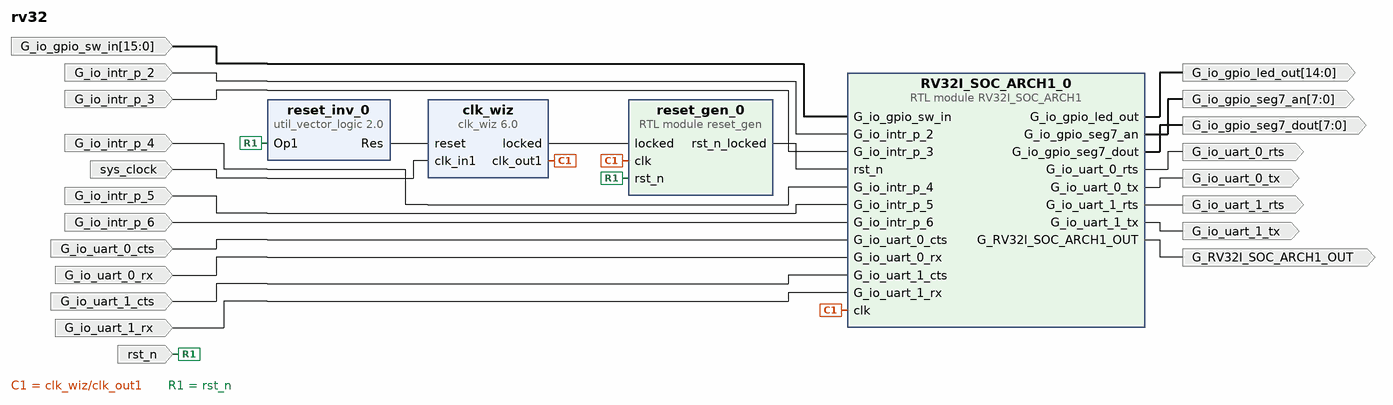
[diagram p0: block diagram of the top level]
# Vivado block design rv32, xc7a100tcsg324-1, Vivado 2024.2
create_bd_design rv32

create_bd_port -dir I -type clk sys_clock
set_property -dict {CONFIG.FREQ_HZ 100000000 CONFIG.PHASE 0.0} [get_bd_ports sys_clock]
create_bd_port -dir I -type rst rst_n
create_bd_port -dir I G_io_uart_0_rx
create_bd_port -dir I G_io_uart_0_cts
create_bd_port -dir I G_io_uart_1_rx
create_bd_port -dir I G_io_uart_1_cts
create_bd_port -dir I -from 15 -to 0 G_io_gpio_sw_in
create_bd_port -dir I G_io_intr_p_2
create_bd_port -dir I G_io_intr_p_3
create_bd_port -dir I G_io_intr_p_4
create_bd_port -dir I G_io_intr_p_5
create_bd_port -dir I G_io_intr_p_6
create_bd_port -dir O G_io_uart_0_tx
create_bd_port -dir O G_io_uart_0_rts
create_bd_port -dir O G_io_uart_1_tx
create_bd_port -dir O G_io_uart_1_rts
create_bd_port -dir O -from 7 -to 0 G_io_gpio_seg7_dout
create_bd_port -dir O -from 7 -to 0 G_io_gpio_seg7_an
create_bd_port -dir O -from 14 -to 0 G_io_gpio_led_out
create_bd_port -dir O G_RV32I_SOC_ARCH1_OUT

create_bd_cell -type module -reference RV32I_SOC_ARCH1 RV32I_SOC_ARCH1_0
create_bd_cell -type ip -vlnv xilinx.com:ip:clk_wiz:6.0 clk_wiz
set_property -dict [list \
  CONFIG.CLKOUT1_REQUESTED_OUT_FREQ 50 \
  CONFIG.CLK_IN1_BOARD_INTERFACE sys_clock \
  CONFIG.RESET_BOARD_INTERFACE reset \
  CONFIG.USE_BOARD_FLOW true \
] [get_bd_cells clk_wiz]
create_bd_cell -type module -reference reset_gen reset_gen_0
create_bd_cell -type ip -vlnv xilinx.com:ip:util_vector_logic:2.0 reset_inv_0
set_property -dict {CONFIG.C_OPERATION not CONFIG.C_SIZE 1} [get_bd_cells reset_inv_0]

# ---- connections ----

connect_bd_net [get_bd_ports G_io_gpio_sw_in] [get_bd_pins RV32I_SOC_ARCH1_0/G_io_gpio_sw_in]
connect_bd_net -net G_io_intr_p_2_1 [get_bd_ports G_io_intr_p_2] [get_bd_pins RV32I_SOC_ARCH1_0/G_io_intr_p_2]
connect_bd_net -net G_io_intr_p_3_1 [get_bd_ports G_io_intr_p_3] [get_bd_pins RV32I_SOC_ARCH1_0/G_io_intr_p_3]
connect_bd_net -net G_io_intr_p_4_1 [get_bd_ports G_io_intr_p_4] [get_bd_pins RV32I_SOC_ARCH1_0/G_io_intr_p_4]
connect_bd_net -net G_io_intr_p_5_1 [get_bd_ports G_io_intr_p_5] [get_bd_pins RV32I_SOC_ARCH1_0/G_io_intr_p_5]
connect_bd_net -net G_io_intr_p_6_1 [get_bd_ports G_io_intr_p_6] [get_bd_pins RV32I_SOC_ARCH1_0/G_io_intr_p_6]
connect_bd_net [get_bd_ports G_io_uart_0_cts] [get_bd_pins RV32I_SOC_ARCH1_0/G_io_uart_0_cts]
connect_bd_net [get_bd_ports G_io_uart_0_rx] [get_bd_pins RV32I_SOC_ARCH1_0/G_io_uart_0_rx]
connect_bd_net [get_bd_ports G_io_uart_1_cts] [get_bd_pins RV32I_SOC_ARCH1_0/G_io_uart_1_cts]
connect_bd_net [get_bd_ports G_io_uart_1_rx] [get_bd_pins RV32I_SOC_ARCH1_0/G_io_uart_1_rx]
connect_bd_net [get_bd_pins RV32I_SOC_ARCH1_0/G_RV32I_SOC_ARCH1_OUT] [get_bd_ports G_RV32I_SOC_ARCH1_OUT]
connect_bd_net [get_bd_pins RV32I_SOC_ARCH1_0/G_io_gpio_led_out] [get_bd_ports G_io_gpio_led_out]
connect_bd_net [get_bd_pins RV32I_SOC_ARCH1_0/G_io_gpio_seg7_an] [get_bd_ports G_io_gpio_seg7_an]
connect_bd_net [get_bd_pins RV32I_SOC_ARCH1_0/G_io_gpio_seg7_dout] [get_bd_ports G_io_gpio_seg7_dout]
connect_bd_net [get_bd_pins RV32I_SOC_ARCH1_0/G_io_uart_0_rts] [get_bd_ports G_io_uart_0_rts]
connect_bd_net [get_bd_pins RV32I_SOC_ARCH1_0/G_io_uart_0_tx] [get_bd_ports G_io_uart_0_tx]
connect_bd_net [get_bd_pins RV32I_SOC_ARCH1_0/G_io_uart_1_rts] [get_bd_ports G_io_uart_1_rts]
connect_bd_net [get_bd_pins RV32I_SOC_ARCH1_0/G_io_uart_1_tx] [get_bd_ports G_io_uart_1_tx]
connect_bd_net [get_bd_pins clk_wiz/clk_out1] [get_bd_pins reset_gen_0/clk] [get_bd_pins RV32I_SOC_ARCH1_0/clk]
connect_bd_net [get_bd_pins clk_wiz/locked] [get_bd_pins reset_gen_0/locked]
connect_bd_net [get_bd_pins reset_gen_0/rst_n_locked] [get_bd_pins RV32I_SOC_ARCH1_0/rst_n]
connect_bd_net [get_bd_pins reset_inv_0/Res] [get_bd_pins clk_wiz/reset]
connect_bd_net [get_bd_ports rst_n] [get_bd_pins reset_gen_0/rst_n] [get_bd_pins reset_inv_0/Op1]
connect_bd_net [get_bd_ports sys_clock] [get_bd_pins clk_wiz/clk_in1]

validate_bd_design
save_bd_design
